# Altium project TrueTouch.PrjPcb
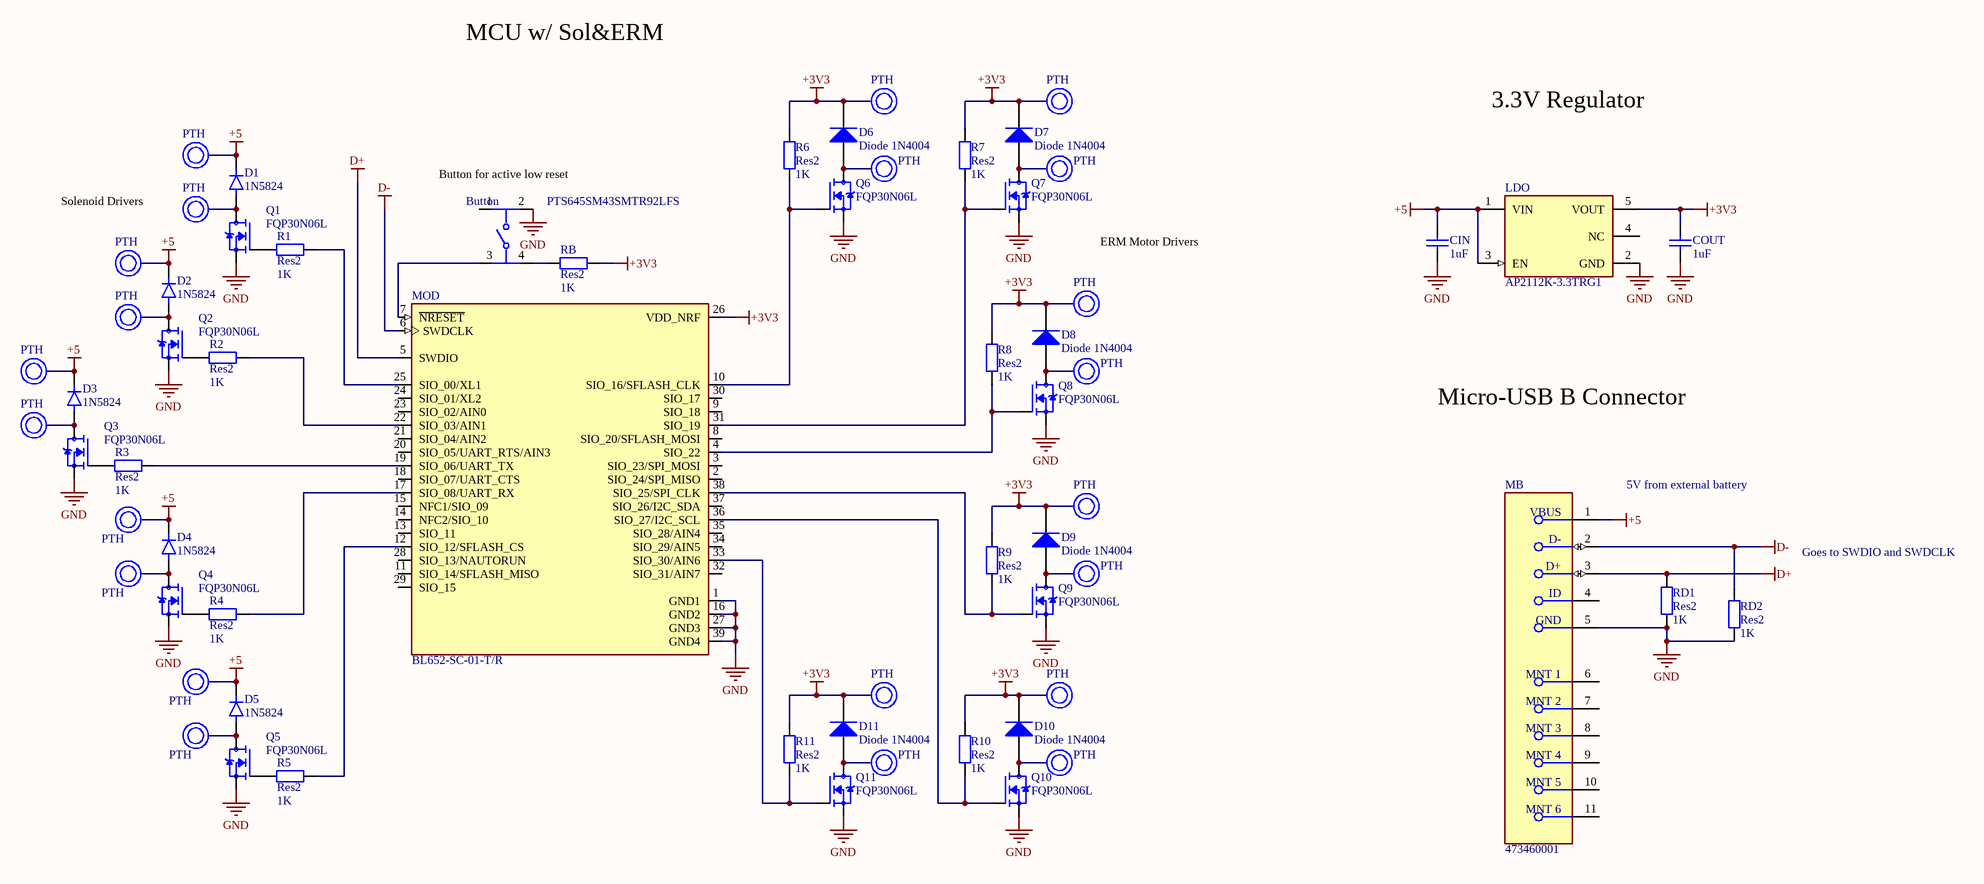
[diagram p0: TrueTouch.SchDoc]
1 sheet, 42 parts. Net scope: global (net labels, ports and power ports of the same name join across sheets).
Board file: TrueTouch.PcbDoc

## Sheet TrueTouch.SchDoc
size D; SheetNumber: 1; SheetTotal: 1

### Parts
Button  PTS645SM43SMTR92LFS  [FP-PTS645SM43SMTR92LFS-MFG]
CIN  1uF  [CAPC2013X140X45NL15T25]
COUT  1uF  [CAPC2013X140X45NL15T25]
D1  1N5824  [DIOAD1898W129L762D1143]
D2  1N5824  [DIOAD1898W129L762D1143]
D3  1N5824  [DIOAD1898W129L762D1143]
D4  1N5824  [DIOAD1898W129L762D1143]
D5  1N5824  [DIOAD1898W129L762D1143]
D6  Diode 1N4004  [DO-41]
D7  Diode 1N4004  [DO-41]
D8  Diode 1N4004  [DO-41]
D9  Diode 1N4004  [DO-41]
D10  Diode 1N4004  [DO-41]
D11  Diode 1N4004  [DO-41]
LDO  AP2112K-3.3TRG1  [FP-SOT25-IPC_A]
MB  473460001  [FP-473460001-MFG]
MOD  BL652-SC-01-T/R  [XCVR_BL652-SC-01-T/R]
Q1  FQP30N06L  [TO220V]
Q2  FQP30N06L  [TO220V]
Q3  FQP30N06L  [TO220V]
Q4  FQP30N06L  [TO220V]
Q5  FQP30N06L  [TO220V]
Q6  FQP30N06L  [TO220V]
Q7  FQP30N06L  [TO220V]
Q8  FQP30N06L  [TO220V]
Q9  FQP30N06L  [TO220V]
Q10  FQP30N06L  [TO220V]
Q11  FQP30N06L  [TO220V]
R1  Res2  value 1K  [AXIAL-0.4]
R2  Res2  value 1K  [AXIAL-0.4]
R3  Res2  value 1K  [AXIAL-0.4]
R4  Res2  value 1K  [AXIAL-0.4]
R5  Res2  value 1K  [AXIAL-0.4]
R6  Res2  value 1K  [AXIAL-0.4]
R7  Res2  value 1K  [AXIAL-0.4]
R8  Res2  value 1K  [AXIAL-0.4]
R9  Res2  value 1K  [AXIAL-0.4]
R10  Res2  value 1K  [AXIAL-0.4]
R11  Res2  value 1K  [AXIAL-0.4]
RB  Res2  value 1K  [AXIAL-0.4]
RD1  Res2  value 1K  [AXIAL-0.4]
RD2  Res2  value 1K  [AXIAL-0.4]

### Nets
+3V3: COUT.2 D6.2(K) D7.2(K) D8.2(K) D9.2(K) D10.2(K) D11.2(K) LDO.5(VOUT) MOD.26(VDD_NRF) R6.1 R7.1 R8.1 R9.1 R10.1 R11.1 RB.2
+5: CIN.2 D1.C(K) D2.C(K) D3.C(K) D4.C(K) D5.C(K) LDO.1(VIN) LDO.3(EN) MB.1(VBUS)
D+: MB.3(D+) MOD.5(SWDIO) RD1.1
D-: MB.2(D-) MOD.6(SWDCLK) RD2.1
GND: Button.2 CIN.1 COUT.1 LDO.2(GND) MB.5(GND) MOD.1(GND1) MOD.16(GND2) MOD.27(GND3) MOD.39(GND4) Q1.3(S) Q2.3(S) Q3.3(S) Q4.3(S) Q5.3(S) Q6.3(S) Q7.3(S) Q8.3(S) Q9.3(S) Q10.3(S) Q11.3(S) RD1.2 RD2.2
NetButton_3: Button.3 MOD.7(~{NRESET})
NetButton_4: Button.4 RB.1
NetD1_A: D1.A Q1.2(D)
NetD2_A: D2.A Q2.2(D)
NetD3_A: D3.A Q3.2(D)
NetD4_A: D4.A Q4.2(D)
NetD5_A: D5.A Q5.2(D)
NetD6_1: D6.1(A) Q6.2(D)
NetD7_1: D7.1(A) Q7.2(D)
NetD8_1: D8.1(A) Q8.2(D)
NetD9_1: D9.1(A) Q9.2(D)
NetD10_1: D10.1(A) Q10.2(D)
NetD11_1: D11.1(A) Q11.2(D)
NetMOD_4: MOD.4(SIO_22) Q8.1(G) R8.2
NetMOD_10: MOD.10(SIO_16/SFLASH_CLK) Q6.1(G) R6.2
NetMOD_12: MOD.12(SIO_12/SFLASH_CS) R5.2
NetMOD_17: MOD.17(SIO_08/UART_RX) R4.2
NetMOD_19: MOD.19(SIO_06/UART_TX) R3.2
NetMOD_22: MOD.22(SIO_03/AIN1) R2.2
NetMOD_25: MOD.25(SIO_00/XL1) R1.2
NetMOD_31: MOD.31(SIO_19) Q7.1(G) R7.2
NetMOD_33: MOD.33(SIO_30/AIN6) Q11.1(G) R11.2
NetMOD_36: MOD.36(SIO_27/I2C_SCL) Q10.1(G) R10.2
NetMOD_38: MOD.38(SIO_25/SPI_CLK) Q9.1(G) R9.2
NetQ1_1: Q1.1(G) R1.1
NetQ2_1: Q2.1(G) R2.1
NetQ3_1: Q3.1(G) R3.1
NetQ4_1: Q4.1(G) R4.1
NetQ5_1: Q5.1(G) R5.1

Not connected (* = marked no-connect by the designer): Button 1; LDO 4(NC); MB 4(ID) 6(MNT_1) 7(MNT_2) 8(MNT_3) 9(MNT_4) 10(MNT_5) 11(MNT_6); MOD 2(SIO_24/SPI_MISO) 3(SIO_23/SPI_MOSI) 8(SIO_20/SFLASH_MOSI) 9(SIO_18) 11(SIO_14/SFLASH_MISO) 13(SIO_11) 14(NFC2/SIO_10) 15(NFC1/SIO_09) 18(SIO_07/UART_CTS) 20(SIO_05/UART_RTS/AIN3) 21(SIO_04/AIN2) 23(SIO_02/AIN0) 24(SIO_01/XL2) 28(SIO_13/NAUTORUN) 29(SIO_15) 30(SIO_17) 32(SIO_31/AIN7) 34(SIO_29/AIN5) 35(SIO_28/AIN4) 37(SIO_26/I2C_SDA)

### Notes on the sheet
- MCU w/ Sol&ERM
- (near D6) PTH
- (near D7) PTH
- 3.3V Regulator
- (near D1) PTH
- PTH
- (near Button) Button for active low reset
- Solenoid Drivers
- (near D2) PTH
- ERM Motor Drivers
- (near D8) PTH
- (near D3) PTH
- Micro-USB B Connector
- 5V from external battery
- Goes to SWDIO and SWDCLK
- (near D11) PTH

### Library data of the parts
Button = CMP-2000-05160-2: SWITCH TACTILE SPST-NO 0.05A 12V; Contact Resistance: 100mR; Throw Configuration: SPST; Illumination Type: Non-Illuminated; Mechanical Life: 100000Cycles; Current Rating: 50mA; Switch Function: Off-Mom; Actuator Length: 0.85mm; Actuator Material: Nylon; Actuator Type: Standard; Operating Force: 160gf; Min Operating Temperature: -20°C; REACH SVHC: No SVHC; Termination: Gull Wing; Case/Package: SMD/SMT; Packaging: Tape and Reel; Mount: Surface Mount; Voltage Rating (DC): 12V; Orientation: Straight; Lead Free: Lead Free; Contact Material: Silver; Color: Black; Max Current Rating: 50mA; Contact Plating: Silver; Depth: 9mm; Package Quantity: 1; Max Voltage Rating (DC): 12V; Length: 6mm; Max Operating Temperature: 60°C
CIN COUT = CMP-2007-03403-1: Part Number: GRM21BR71E105KA99L; Manufacturer: Murata
D1-D5 = 1N5824: Diode Schottky 30V 5A Through Hole Axial; MF: Microsemi Corporation; Value: *; SnapEDA_Link: https://www.snapeda.com/parts/1N5824/Microsemi%20Corporation/view-part/49055/?ref=snap; MP: 1N5824; Availability: Unavailable; Price: None; Package: Axial Microsemi
D6-D11 = Diode 1N4004: 1 Amp General Purpose Rectifier; Published: 8-Jun-2000; LatestRevisionDate: 17-Jul-2002; LatestRevisionNote: Re-released for DXP Platform.; DatasheetVersion: 1998; PackageVersion: Aug-1999; PackageReference: DO-41; Publisher: Altium Limited; PackageDescription: Diode, Axial; Body 5.2 x 2.7 mm (LxDia. max), Lead Dia. 0.86 mm (max); Code_JEDEC: DO-204-AL; ComponentLink1Description: Manufacturer Link; ComponentLink1URL: http://www.fairchildsemi.com/; ComponentLink2Description: Datasheet; ComponentLink2URL: http://www.fairchildsemi.com/ds/1N%2F1N4001.pdf
LDO = CMP-12756-000035-1: IC REG LINEAR 3.3V 600MA SOT25; Number of Regulators: 1; Output Type: Fixed; Polarity: Positive; Min Input Voltage: 2.5V; Max Input Voltage: 6V; Accuracy: 1.5%; Quiescent Current: 55uA; Dropout Voltage: 250mV; Min Operating Temperature: -40°C; Length: 3.1mm; Output Current: 600mA; Max Operating Temperature: 85°C; Package Quantity: 1; Output Voltage: 3.3V; Width: 1.7mm; Number of Outputs: 1; Packaging: Tape and Reel; Height: 1.3mm; Lead Free: Lead Free; Max Output Current: 600mA; Case/Package: SOT-23-5; Mount: Surface Mount; Number of Pins: 5
MB = CMP-2000-05246-2: CONN RCPT USB2.0 MICRO B SMD R/A; Manufacturer: Molex; Conn Orientation: Right Angle; Is Female: yes; Shielding: true; Pitch: 0.65mm; Number Of Contacts: 5; Voltage Rating: 30V; Current Rating: 1.8A; Device Class L2: USB Connectors; Digikey Description: CONN RCPT USB2.0 MICRO B SMD R/A; Height: 2.945mm; RoHS: TRUE; ComponentLink2Description: Datasheet; Octopart: https://octopart.com/47346-0001-molex-7164928; Automotive: No; Package: 0; Category: Conn; Device Class L1: Connectors; Usb Standard: USB 2.0; Temperature: -30°C to +85°C; Temperature Range Low: -30°C; Footprint Url: https://www.molex.com/pdm_docs/sd/473460001_sd.pdf; ComponentLink2URL: https://www.molex.com/webdocs/datasheets/pdf/en-us/0473460001_IO_CONNECTORS.pdf; Lead Free: Yes; Manufacturer Part Number: 473460001; Contact Material: Gold,Nickel; Temperature Range High: +85°C; Device Class L3: unset
MOD = BL652-SC-01-T/R: Bluetooth Bluetooth v5.0 Transceiver Module 2.4GHz Antenna Not Included, I-PEX MHF4 Surface Mount; MF: Laird -; Digi-Key_Part_Number: BL652-SC-01-CT-ND; DigiKey-Purchase-URL: https://snapeda.com/shop?store=DigiKey&id=1215493; Package: SMD-39 Laird; SnapEDA_Link: https://www.snapeda.com/parts/BL652-SC-01-T/R/Laird%20-%20Wireless%20&%20Thermal%20Systems/view-part/1215493/?ref=snap; Value: *; MP: BL652-SC-01-T/R
Q1-Q11 = FQP30N06L: N-Channel 60V 32A _Tc_ 79W _Tc_ Through Hole TO-220-3; MF: ON Semiconductor; Package: TO-220 ON Semiconductor; Price: None; Availability: Unavailable; MP: FQP30N06L; SnapEDA_Link: https://www.snapeda.com/parts/FQP30N06L/ON%20Semiconductor/view-part/1413126/?ref=snap; Value: *
R1-R11 RB RD1 RD2 = Res2: Resistor; Published: 8-Jun-2000; LatestRevisionDate: 17-Jul-2002; LatestRevisionNote: Re-released for DXP Platform.; PackageReference: AXIAL-0.4; Publisher: Altium Limited; PackageDescription: Axial Device, Thru-Hole; 2 Leads; 0.4 in Pin Spacing